# Altium schematic sheet 1_APO Connectors.schdoc
size 309 x 223 mm; Symbol: Sheet-Symbol_A4; Device: Sheet-Symbol_A4; Company: EasyEDA.com; Drawed: EasyEDA Pro; Reviewed: EasyEDA Pro; Version: V0.1; Page Size: A4; @Project Name: TUD-EnergyHarvestingConsole_2022-08-29_17-01-09; @Page Count: 4; @Update Date: 2022-11-21; @Create Date: 2022-11-19; @Schematic Name: Schematic1; Part Number: JLCPCB-002; @Page No: 2; @Page Name: APO Connectors
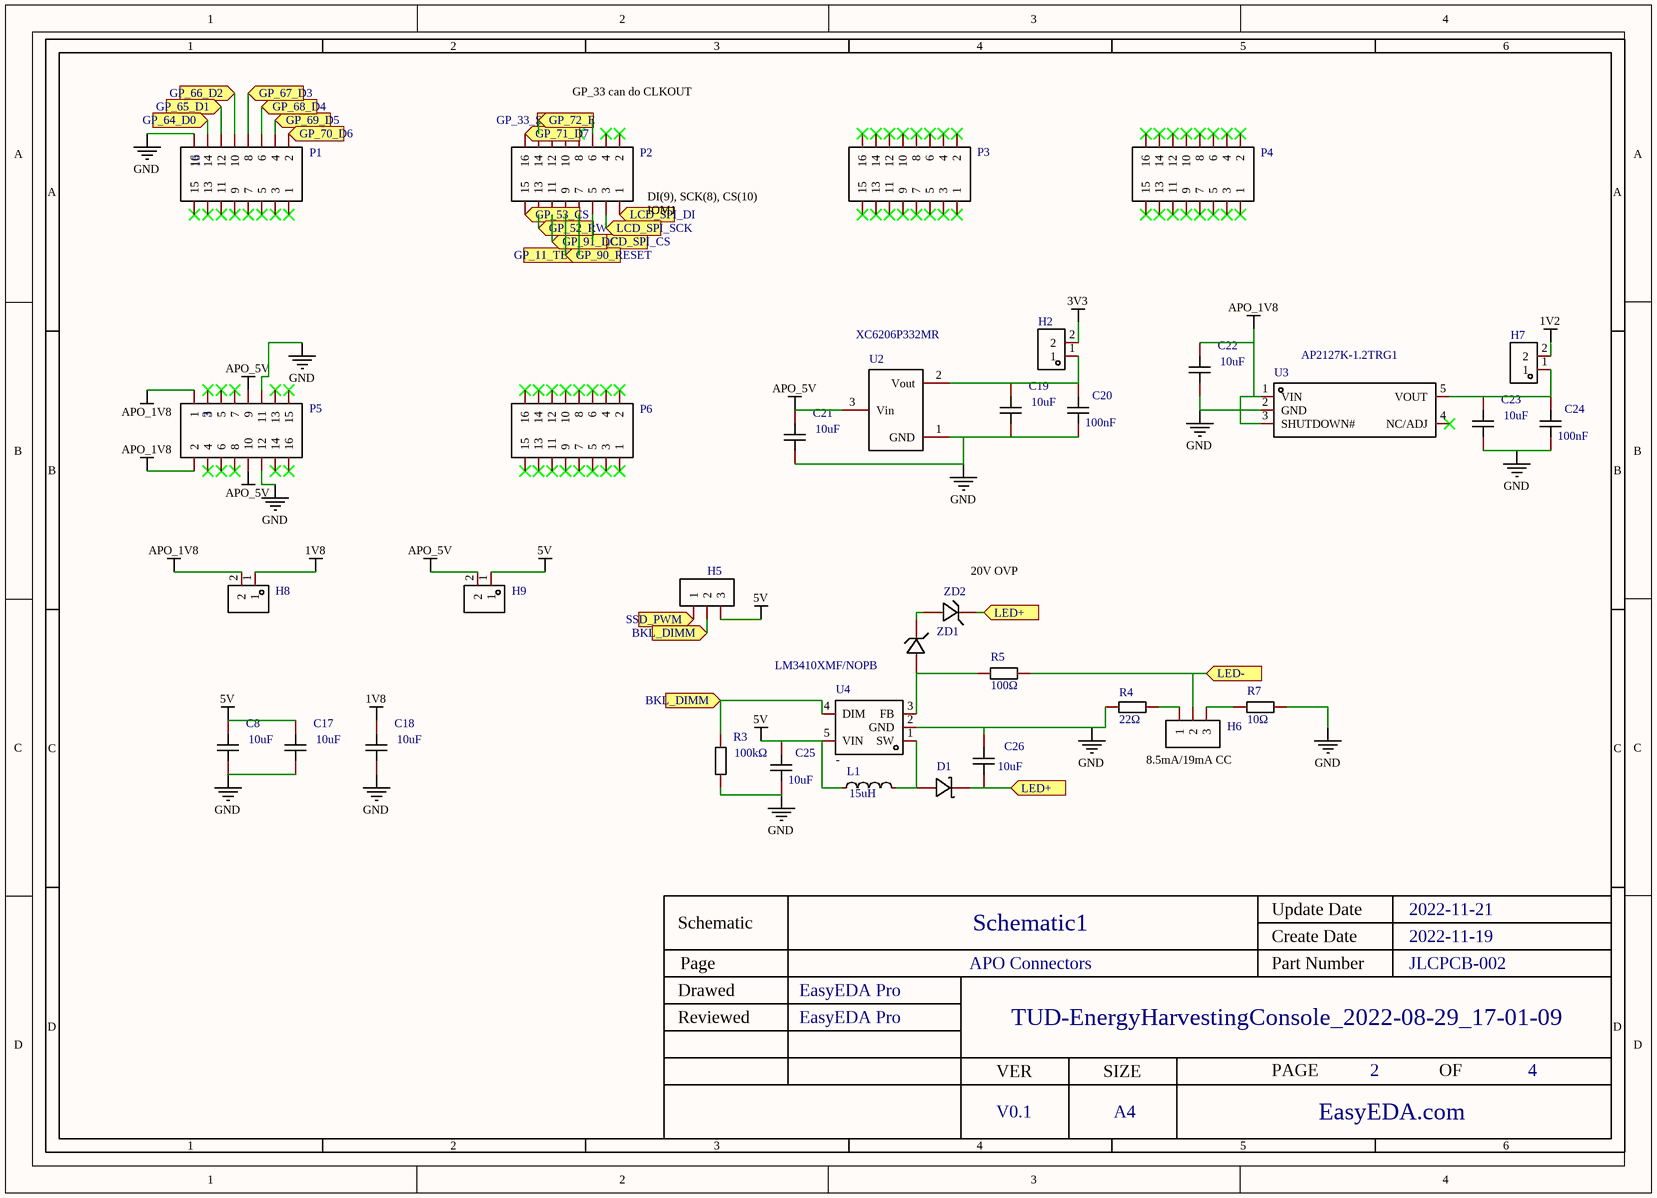
[diagram p0: 1_APO Connectors.schdoc]

## Parts
C8  value 10uF  [C0603]  (hidden comment: CL10A106MA8NRNC)
C17  value 10uF  [C0603]  (hidden comment: CL10A106MA8NRNC)
C18  value 10uF  [C0603]  (hidden comment: CL10A106MA8NRNC)
C19  value 10uF  [C0603]  (hidden comment: CL10A106MA8NRNC)
C20  value 100nF  [C0603]  (hidden comment: CC0603KRX7R9BB104)
C21  value 10uF  [C0603]  (hidden comment: CL10A106MA8NRNC)
C22  value 10uF  [C0603]  (hidden comment: CL10A106MA8NRNC)
C23  value 10uF  [C0603]  (hidden comment: CL10A106MA8NRNC)
C24  value 100nF  [C0603]  (hidden comment: CC0603KRX7R9BB104)
C25  value 10uF  [C0603]  (hidden comment: CL10A106MA8NRNC)
C26  value 10uF  [C0603]  (hidden comment: CL10A106MA8NRNC)
D1  SS210_C14996  [SMA_L4.3-W2.6-LS5.2-RD]  (value not drawn)
H2  PZ254V-11-02P  [HDR-TH_2P-P2.54-V-M]  (value not drawn)
H5  2.54-1*3P针  [HDR-TH_3P-P2.54-V-M-1]  (value not drawn)
H6  2.54-1*3P针  [HDR-TH_3P-P2.54-V-M-1]  (value not drawn)
H7  PZ254V-11-02P  [HDR-TH_2P-P2.54-V-M]  (value not drawn)
H8  PZ254V-11-02P  [HDR-TH_2P-P2.54-V-M]  (value not drawn)
H9  PZ254V-11-02P  [HDR-TH_2P-P2.54-V-M]  (value not drawn)
L1  value 15uH  [IND-SMD_L4.5-W4.0_SCD0403T]  (hidden comment: MSA43-150M)
P1  NAME: 16  [HDR-TH_16P-P2.54-V-M-R2-C8-S2.54]  (hidden comment: 2.54-2*8P针_C68234)
P2  2.54-2*8P针_C68234  [HDR-TH_16P-P2.54-V-M-R2-C8-S2.54]  (value not drawn)
P3  2.54-2*8P针_C68234  [HDR-TH_16P-P2.54-V-M-R2-C8-S2.54]  (value not drawn)
P4  2.54-2*8P针_C68234  [HDR-TH_16P-P2.54-V-M-R2-C8-S2.54]  (value not drawn)
P5  NAME: 3  [HDR-TH_16P-P2.54-V-M-R2-C8-S2.54]  (hidden comment: 2.54-2*8P针_C68234)
P6  2.54-2*8P针_C68234  [HDR-TH_16P-P2.54-V-M-R2-C8-S2.54]  (value not drawn)
R3  value 100kΩ  [R0603]  (hidden comment: 0603WAF1003T5E)
R4  value 22Ω  [R0603]  (hidden comment: 0603WAF220JT5E)
R5  value 100Ω  [R0603]  (hidden comment: 0603WAF1000T5E)
R7  value 10Ω  [R0603]  (hidden comment: RS-03K10R0FT)
U2  Manufacturer Part: XC6206P332MR  [SOT-23-3_L2.9-W1.6-P1.90-LS2.8-BR]  (hidden comment: XC6206P332MR_C5446)
U3  AP2127K-1.2TRG1  [SOT-23-5_L3.0-W1.7-P0.95-LS2.8-BR]
U4  LM3410XMF/NOPB  [SOT-23-5_L3.0-W1.7-P0.95-LS2.8-BR]
ZD1  MMSZ5240B_C21564  [SOD-123_L2.8-W1.8-LS3.7-RD]  (value not drawn)
ZD2  MMSZ5240B_C21564  [SOD-123_L2.8-W1.8-LS3.7-RD]  (value not drawn)

## Ports
BKL_DIMM (in), GP_11_TE (in), GP_33_SSDCLK (in), GP_52_RW (in), GP_53_CS (in), GP_64_D0 (in), GP_65_D1 (in), GP_66_D2 (in), GP_67_D3 (in), GP_68_D4 (in), GP_69_D5 (in), GP_70_D6 (in), GP_71_D7 (in), GP_72_E (in), GP_90_RESET (in), GP_91_DC (in), LCD_SPI_CS (in), LCD_SPI_DI (in), LCD_SPI_SCK (in), LED+ (in), LED- (in), SSD_PWM (in)

## Nets
1V2: H7.2
1V8: C18.2 H8.1
3V3: H2.2
5V: C8.2 C17.2 C25.2 H5.3 H9.1 L1.1 U4.5(VIN)
APO_1V8: C22.2 H8.2 P5.1 P5.2 U3.1(VIN) U3.3(SHUTDOWN#)
APO_5V: C21.2 H9.2 P5.9 P5.10 U2.3(Vin)
GND: C8.1 C17.1 C18.1 C19.1 C20.1 C21.1 C22.1 C23.1 C24.1 C25.1 C26.2 P1.16 P5.11 P5.12 R3.1 R4.2 R7.2 U2.1(GND) U3.2(GND) U4.2(GND)
BKL_DIMM: H5.2 R3.2 U4.4(DIM) ; port BKL_DIMM
GP_11_TE: P2.7 ; port GP_11_TE
GP_33_SSDCLK: P2.6 ; port GP_33_SSDCLK
GP_52_RW: P2.13 ; port GP_52_RW
GP_53_CS: P2.15 ; port GP_53_CS
GP_64_D0: P1.14 ; port GP_64_D0
GP_65_D1: P1.12 ; port GP_65_D1
GP_66_D2: P1.10 ; port GP_66_D2
GP_67_D3: P1.8 ; port GP_67_D3
GP_68_D4: P1.6 ; port GP_68_D4
GP_69_D5: P1.4 ; port GP_69_D5
GP_70_D6: P1.2 ; port GP_70_D6
GP_71_D7: P2.16 ; port GP_71_D7
GP_72_E: P2.14 ; port GP_72_E
GP_90_RESET: P2.9 ; port GP_90_RESET
GP_91_DC: P2.11 ; port GP_91_DC
LCD_SPI_CS: P2.5 ; port LCD_SPI_CS
LCD_SPI_DI: P2.1 ; port LCD_SPI_DI
LCD_SPI_SCK: P2.3 ; port LCD_SPI_SCK
LED+: C26.1 D1.1(K) ZD2.1(K) ; port LED+
LED-: H6.2 R5.2 ; port LED-
SSD_PWM: H5.1 ; port SSD_PWM
NetC19_2: C19.2 C20.2 H2.1 U2.2(Vout)
NetC23_2: C23.2 C24.2 H7.1 U3.5(VOUT)
NetD1_2: D1.2(A) L1.2 U4.1(SW)
NetH6_1: H6.1 R4.1
NetH6_3: H6.3 R7.1
NetR5_1: R5.1 U4.3(FB) ZD1.2(A)
NetZD1_1: ZD1.1(K) ZD2.2(A)

Not connected (* = marked no-connect by the designer): P1 1* 3* 5* 7* 9* 11* 13* 15*; P2 2* 4* 8* 10* 12*; P3 1* 2* 3* 4* 5* 6* 7* 8* 9* 10* 11* 12* 13* 14* 15* 16*; P4 1* 2* 3* 4* 5* 6* 7* 8* 9* 10* 11* 12* 13* 14* 15* 16*; P5 3* 4* 5* 6* 7* 8* 13* 14* 15* 16*; P6 1* 2* 3* 4* 5* 6* 7* 8* 9* 10* 11* 12* 13* 14* 15* 16*; U3 4(NC/ADJ)*

## Notes on the sheet
- (near P2) GP_33 can do CLKOUT
- (near P2) DI(9), SCK(8), CS(10)
  IOM1
- (near ZD2) 20V OVP
- 8.5mA/19mA CC
- 1
- 2
- 3
- 4
- 5
- 6
- A
- B
- C
- Schematic
- Schematic1
- Create Date
- Update Date
- 2022-11-21
- 2022-11-19
- Reviewed
- Drawed
- Page
- EasyEDA Pro
- APO Connectors
- Part Number
- TUD-EnergyHarvestingConsole_2022-08-29_17-01-09
- JLCPCB-002
- D
- VER
- SIZE
- PAGE
- OF
- V0.1
- A4
- EasyEDA.com

## Library data of the parts
C8 C17-C19 C21-C23 C25 C26 = CL10A106MA8NRNC: Capacitance: Tolerance:±20% Tolerance:±20% Voltage Rated: Temperature Coefficient:; Manufacturer: SAMSUNG(三星); Add into BOM: yes; Tolerance: ±20%; Name: 10uF; Symbol: CL10A106MA8NRNC; Device: CL10A106MA8NRNC; LCSC Part Name: 10uF ±20% 25V; Supplier Part: C96446; Manufacturer Part: CL10A106MA8NRNC; Supplier Footprint: 0603; JLCPCB Part Class: Basic Part; Datasheet: https://atta.szlcsc.com/upload/public/pdf/source/20170325/1490427913016.pdf; Supplier: LCSC; Convert to PCB: yes
C20 C24 = CC0603KRX7R9BB104: Capacitance: Tolerance:±10% Tolerance:±10% Voltage Rated: Temperature Coefficient:; Manufacturer: YAGEO(国巨); Add into BOM: yes; Tolerance: ±10%; Name: 100nF; Symbol: CC0603KRX7R9BB104; Device: CC0603KRX7R9BB104; LCSC Part Name: 100nF ±10% 50V; Supplier Part: C14663; Manufacturer Part: CC0603KRX7R9BB104; Supplier Footprint: 0603; JLCPCB Part Class: Basic Part; Datasheet: https://atta.szlcsc.com/upload/public/pdf/source/20170116/1484561234239.pdf; Supplier: LCSC; Convert to PCB: yes
D1 = SS210_C14996: Reverse Voltage (Vr):100V Average Rectified Current (Io):2A Forward Voltage (Vf@If):850mV@2A; Manufacturer: MDD; Name: SS210; Add into BOM: yes; Reverse Voltage (Vr): 100V; Average Rectified Current (Io): 2A; Symbol: SS210; Device: SS210_C14996; LCSC Part Name: 100V 2A 850mV@2A; Supplier Part: C14996; Manufacturer Part: SS210; Supplier Footprint: SMA(DO-214AC); JLCPCB Part Class: Basic Part; Datasheet: https://atta.szlcsc.com/upload/public/pdf/source/20190304/C14996_C9642665EC53B919CC87DB9E28DB3D1C.pdf; Supplier: LCSC; Convert to PCB: yes; Forward Voltage (Vf@If): 850mV@2A
H2 H7-H9 = PZ254V-11-02P: Pitch:2.54mm Number of Pins:2 Number of Rows: Pin Structure:1x2P Row Spacing:- Mounting Type:Straight Circluar Pins/Square Pins:Square Pins Current Rating (Max):- Voltage Rating (Max):- Length of Mating Pin:6mm Insulation Height:2.5mm Length of End Connec; Manufacturer: XFCN(兴飞); Add into BOM: yes; Pitch: 2.54mm; Pin Structure: 1x2P; Name: PZ254V-11-02P; Symbol: PZ254V-11-02P; Device: PZ254V-11-02P; LCSC Part Name: 2.54mm 1x2P 直插 方针; Supplier Part: C492401; Manufacturer Part: PZ254V-11-02P; Supplier Footprint: 插件,P=2.54mm; JLCPCB Part Class: Extended Part; Datasheet: https://atta.szlcsc.com/upload/public/pdf/source/20200309/C492401_A812433581A9B211A7FFA413ADDFF0E5.pdf; Supplier: LCSC; Convert to PCB: yes; Number of Pins: 2; Row Spacing: -; Mounting Type: Straight; Circluar Pins/Square Pins: Square Pins; Current Rating (Max): -; Voltage Rating (Max): -; Length of Mating Pin: 6mm; Insulation Height: 2.5mm; Length of End Connection Pin: 3mm; Contact Plating: -; Operating Temperature Range: -40~+105; Color: Black
H5 H6 = 2.54-1*3P针: Pitch:2.54mm Number of Pins:3 Number of Rows: Pin Structure:1x3P Row Spacing:- Mounting Type:Straight Circluar Pins/Square Pins:Square Pins Current Rating (Max):3A Voltage Rating (Max):- Length of Mating Pin:- Insulation Height:- Length of End Connection; Manufacturer: BOOMELE(博穆精密); Symbol: Header-Male-2.54_1x3; Add into BOM: yes; Pitch: 2.54mm; Pin Structure: 1x3P; Current Rating (Max): 3A; Name: 2.54-1*3P针; Device: 2.54-1*3P针; LCSC Part Name: 2.54mm 1x3P 直插 方针; Supplier Part: C49257; Manufacturer Part: 2.54-1*3P针; Supplier Footprint: 插件,P=2.54mm; JLCPCB Part Class: Extended Part; Datasheet: https://atta.szlcsc.com/upload/public/pdf/source/20151109/1457707570948.pdf; Supplier: LCSC; Convert to PCB: yes; Number of Pins: 3; Row Spacing: -; Mounting Type: Straight; Circluar Pins/Square Pins: Square Pins; Voltage Rating (Max): -; Length of Mating Pin: -; Insulation Height: -; Length of End Connection Pin: -; Contact Plating: -; Operating Temperature Range: -40~+105; Color: Black
L1 = MSA43-150M: Inductance:15uH Tolerance:±20% Tolerance:±20% Rated Current:1.2A DC Resistance (DCR):186mΩ; Manufacturer: COILMX(迈翔科技); Add into BOM: yes; Tolerance: ±20%; Rated Current: 1.2A; DC Resistance (DCR): 186mΩ; Name: 15uH; Symbol: MSA43-150M; Device: MSA43-150M; LCSC Part Name: 15uH ±20% 1.2A 186mΩ; Supplier Part: C396400; Manufacturer Part: MSA43-150M; Supplier Footprint: SMD; JLCPCB Part Class: Extended Part; Datasheet: https://atta.szlcsc.com/upload/public/pdf/source/20190603/C396400_B880A7A472A67203FE6E2CE09E4CD4E5.pdf; Supplier: LCSC; Convert to PCB: yes
P1-P6 = 2.54-2*8P针_C68234: Pitch:2.54mm Number of Pins:16 Number of Rows: Pin Structure:2x8P Row Spacing:2.54mm Mounting Type:Straight Circluar Pins/Square Pins:Square Pins Current Rating (Max):- Voltage Rating (Max):- Length of Mating Pin:5.9mm Insulation Height:2.54mm Length of E; Manufacturer: BOOMELE(博穆精密); Symbol: Header-Male-2.54_2x8; Add into BOM: yes; Pitch: 2.54mm; Pin Structure: 2x8P; Name: 2.54-2*8P针; Device: 2.54-2*8P针_C68234; LCSC Part Name: 2.54mm 2x8P 直插 方针; Supplier Part: C68234; Manufacturer Part: 2.54-2*8P针; Supplier Footprint: 插件,P=2.54mm; JLCPCB Part Class: Extended Part; Datasheet: https://atta.szlcsc.com/upload/public/pdf/source/20201013/C68234_270B646BD674B577F54EFAA72CA8674A.pdf; Supplier: LCSC; Convert to PCB: yes; Number of Pins: 16; Row Spacing: 2.54mm; Mounting Type: Straight; Circluar Pins/Square Pins: Square Pins; Current Rating (Max): -; Voltage Rating (Max): -; Length of Mating Pin: 5.9mm; Insulation Height: 2.54mm; Length of End Connection Pin: -; Contact Plating: -; Operating Temperature Range: -; Welding Temperature (Max): -; Color: Black
R3 = 0603WAF1003T5E: Type:Thick Film Resistors Resistance: Tolerance:±1% Tolerance:±1% Power(Watts): Temperature Coefficient:±100ppm/ Temperature Coefficient:±100ppm/ Overload Voltage (Max): Operating Temperature Range:-55~+155 Operating Temperature Range:-55~+155; Manufacturer: UNI-ROYAL(厚声); Add into BOM: yes; Tolerance: ±1%; Name: 100kΩ; Symbol: 0603WAF1003T5E; Device: 0603WAF1003T5E; LCSC Part Name: 100kΩ ±1% 100mW; Supplier Part: C25803; Manufacturer Part: 0603WAF1003T5E; Supplier Footprint: 0603; JLCPCB Part Class: Basic Part; Datasheet: https://atta.szlcsc.com/upload/public/pdf/source/20200306/C422600_1E6D84923E4A46A82E41ADD87F860B5C.pdf; Supplier: LCSC; Convert to PCB: yes; Type: Thick Film Resistors; Temperature Coefficient: ±100ppm/; Operating Temperature Range: -55~+155
R4 = 0603WAF220JT5E: Type:Thick Film Resistors Resistance: Tolerance:±1% Tolerance:±1% Power(Watts): Temperature Coefficient:±100ppm/ Temperature Coefficient:±100ppm/ Overload Voltage (Max): Operating Temperature Range:-55~+155 Operating Temperature Range:-55~+155; Manufacturer: UNI-ROYAL(厚声); Add into BOM: yes; Tolerance: ±1%; Symbol: 0603WAF220JT5E; Device: 0603WAF220JT5E; LCSC Part Name: 22Ω ±1% 100mW; Supplier Part: C23345; Manufacturer Part: 0603WAF220JT5E; Supplier Footprint: 0603; JLCPCB Part Class: Basic Part; Datasheet: https://atta.szlcsc.com/upload/public/pdf/source/20200306/C422600_1E6D84923E4A46A82E41ADD87F860B5C.pdf; Supplier: LCSC; Convert to PCB: yes; Type: Thick Film Resistors; Temperature Coefficient: ±100ppm/; Operating Temperature Range: -55~+155
R5 = 0603WAF1000T5E: Type:Thick Film Resistors Resistance: Tolerance:±1% Tolerance:±1% Power(Watts): Temperature Coefficient:±200ppm/ Temperature Coefficient:±200ppm/ Overload Voltage (Max): Operating Temperature Range:-55~+155 Operating Temperature Range:-55~+155; Manufacturer: UNI-ROYAL(厚声); Add into BOM: yes; Tolerance: ±1%; Name: 100Ω; Symbol: 0603WAF1000T5E; Device: 0603WAF1000T5E; LCSC Part Name: 100Ω ±1% 100mW; Supplier Part: C22775; Manufacturer Part: 0603WAF1000T5E; Supplier Footprint: 0603; JLCPCB Part Class: Basic Part; Datasheet: https://atta.szlcsc.com/upload/public/pdf/source/20200306/C422600_1E6D84923E4A46A82E41ADD87F860B5C.pdf; Supplier: LCSC; Convert to PCB: yes; Type: Thick Film Resistors; Temperature Coefficient: ±200ppm/; Operating Temperature Range: -55~+155
R7 = RS-03K10R0FT: Tolerance: Resistance: Temperature Coefficient: Temperature Coefficient: Power(Watts): Overload Voltage (Max): Operating Temperature Range: Operating Temperature Range:; Manufacturer: FH(风华); Add into BOM: yes; Name: 10Ω; Symbol: RS-03K10R0FT; Device: RS-03K10R0FT; LCSC Part Name: 10Ω(10R0) ±1%; Supplier Part: C136596; Manufacturer Part: RS-03K10R0FT; Supplier Footprint: 0603; JLCPCB Part Class: Extended Part; Datasheet: https://atta.szlcsc.com/upload/public/pdf/source/20171113/C136596_15105610953121115484.pdf; Supplier: LCSC; Convert to PCB: yes
U2 = XC6206P332MR_C5446: Output Type: Output Polarity:Positive Number of Outputs:1 Maximum Input Voltage:6V Output Voltage:3.3V~3.3V Output Voltage:3.3V~3.3V Dropout Voltage:680mV@(100mA) Output Current:200mA Power Supply Rejection Ratio (PRSS):-; Manufacturer: TOREX(特瑞仕); Add into BOM: yes; Number of Outputs: 1; Maximum Input Voltage: 6V; Output Current: 200mA; Name: XC6206P332MR; Symbol: XC6206P332MR; Device: XC6206P332MR_C5446; LCSC Part Name: Vin=6V Vout=3.3V 200mA; Supplier Part: C5446; Supplier Footprint: SOT-23-3L; JLCPCB Part Class: Basic Part; Datasheet: https://atta.szlcsc.com/upload/public/pdf/source/20130801/1457706628791.pdf; Supplier: LCSC; Convert to PCB: yes; Output Polarity: Positive; Output Voltage: 3.3V~3.3V; Dropout Voltage: 680mV@(100mA); Power Supply Rejection Ratio (PRSS): -
U3 = AP2127K-1.2TRG1: Output Type: Output Polarity:Positive Number of Outputs:1 Maximum Input Voltage:6V Output Voltage:1.2V~1.2V Output Voltage:1.2V~1.2V Dropout Voltage:1.3V@(300mA) Output Current:300mA Power Supply Rejection Ratio (PSRR):68dB@(100Hz,1kHz),54dB@(10kHz); Manufacturer: DIODES(美台); Add into BOM: yes; Number of Outputs: 1; Maximum Input Voltage: 6V; Name: AP2127K-1.2TRG1; Symbol: AP2127K-1.2TRG1; Device: AP2127K-1.2TRG1; LCSC Part Name: 正 Vin=6V Vout=1.2V~1.2V 300mA 68dB; Supplier Part: C151376; Manufacturer Part: AP2127K-1.2TRG1; Supplier Footprint: SOT-23-5; JLCPCB Part Class: Extended Part; Datasheet: https://atta.szlcsc.com/upload/public/pdf/source/20171221/C151376_15138312836001195553.pdf; Supplier: LCSC; Convert to PCB: yes; Output Polarity: Positive; Output Voltage: 1.2V~1.2V; Dropout Voltage: 1.3V@(300mA); Output Current: 300mA; Power Supply Rejection Ratio (PSRR): 68dB@(100Hz,1kHz),54dB@(10kHz)
U4 = LM3410XMF/NOPB: Type:- Topology:- Internal Switch(s):- Number of Outputs:- Supply Voltage (Min):- Supply Voltage (Max):- Output Voltage:- Output / Channel Current:- Dimming Control:- Frequency:- Operating Temperature:-; Manufacturer: TI(德州仪器); Add into BOM: yes; Name: -; Symbol: LM3410XMF/NOPB; Device: LM3410XMF/NOPB; LCSC Part Name: LM3410XMF/NOPB; Supplier Part: C524797; Manufacturer Part: LM3410XMF/NOPB; Supplier Footprint: SOT-23-5; JLCPCB Part Class: Extended Part; Datasheet: https://atta.szlcsc.com/upload/public/pdf/source/20200429/C524797_FC0006ECD5E62CD6918CA6FFF9884139.pdf; Supplier: LCSC; Convert to PCB: yes; Type: -; Topology: -; Internal Switch(s): -; Number of Outputs: -; Supply Voltage (Min): -; Supply Voltage (Max): -; Output Voltage: -; Output / Channel Current: -; Dimming Control: -; Value: -; Operating Temperature: -
ZD1 ZD2 = MMSZ5240B_C21564: Diode Configuration:Single Zener Voltage (Nom):10V Zener Voltage (Range):9.5V~10.5V Zener Voltage (Range):9.5V~10.5V Tolerance:- Tolerance:- Power Dissipation:350mW Reverse Leakage Current (Ir):3A@8V Zener Impedance (Zzt):17Ω; Manufacturer: CJ（江苏长电/长晶）; Add into BOM: yes; Diode Configuration: Single; Zener Voltage (Nom): 10V; Power Dissipation: 350mW; Reverse Leakage Current (Ir): 3A@8V; Zener Impedance (Zzt): 17Ω; Name: MMSZ5240B; Symbol: MMSZ5240B; Device: MMSZ5240B_C21564; LCSC Part Name: 10V 350mW 10V  F5; Supplier Part: C21564; Manufacturer Part: MMSZ5240B; Supplier Footprint: SOD-123; JLCPCB Part Class: Extended Part; Datasheet: https://atta.szlcsc.com/upload/public/pdf/source/20140301/1457707002400.pdf; Supplier: LCSC; Convert to PCB: yes; Zener Voltage (Range): 9.5V~10.5V; Tolerance: -